# Altium project smartport_inverter.PrjPcb
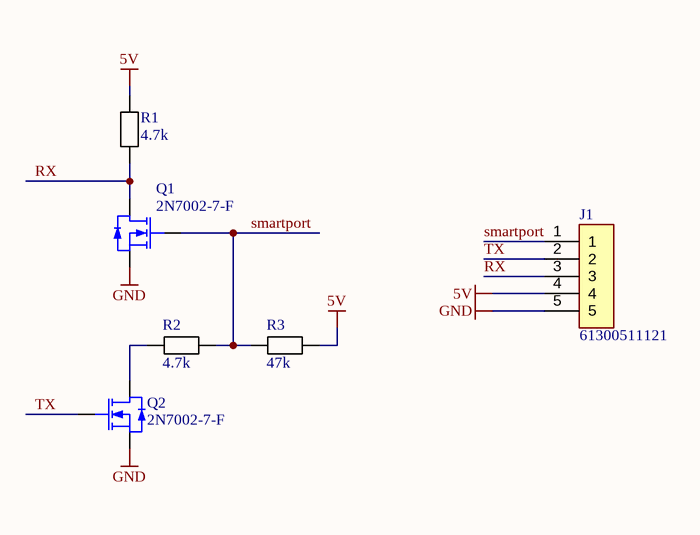
[diagram p0: smartport_inverter.SchDoc]
1 sheet, 6 parts. Net scope: hierarchical (ports join the sheet entries above them; power ports are global).
Board files: smartport_inverter_Panel5X5.PcbDoc, smartport_inverter.PcbDoc

## Sheet smartport_inverter.SchDoc
size 420 x 297 mm

### Parts
J1  61300511121  [61300511121]
Q1  2N7002-7-F  [SOT23-3N]
Q2  2N7002-7-F  [SOT23-3N]
R1  4.7k  [R0603]
R2  4.7k  [R0603]
R3  47k  [R0603]

### Nets
5V: J1.4 R1.2 R3.1
GND: J1.5 Q1.2(S) Q2.2(S)
RX: J1.3 Q1.3(D) R1.1
smartport: J1.1 Q1.1(G) R2.1 R3.2
TX: J1.2 Q2.1(G)
NetQ2_3: Q2.3(D) R2.2

### Notes on the sheet
- THIS DOCUMENT AND THE DATA DISCLOSED HEREIN OR
- HEREWITH IS THE PROPERTY OF ALTIUM LIMITED AND MAY
- DWG NO:
- REVISION
- REV:
- DESCRIPTION
- DATE
- APPROVED
- BE FREELY DISTRIBUTED IN WHOLE. NO RIGHTS ARE
- RESERVED OR EXPRESS OR IMPLIED WARANTEE GIVEN.
- ENG:
- APPROVALS
- PROJECT
- DSN:
- CHK:
- REFERENCE DOCUMENTS
- PROJECT REVISION:
- TITLE
- DOCUMENT REVISION:
- DESIGN ITEM:
- BOM:
- FAB DWG:
- PCB DWG:
- ASSY DWG:
- SCALE:
- A3
- SIZE
- CAGE CODE
- FILE NAME
- DWG NO.
- SHEET
- OF
- REV

### Library data of the parts
J1 = 61300511121: Headers & Wire Housings WR-PHD 2.54mm Hdr 5P Single Str Gold; Manufacturer: Wurth Elektronik; Manufacturer Part Number: 61300511121; Value: 61300511121
Q1 Q2 = 2N7002-7-F: MOSFET N-CH 60V 200MA SOT23-3; Manufacturer: Diodes Incorporated; Manufacturer Part Number: 2N7002-7-F; Value: 2N7002-7-F
R1 R2 = RES_YAG_RC0603FR-074K7L: Resistor 4.7k 0603 +-1% 0.1; Manufacturer: Yageo; Temperature Coefficient: +-200ppm°C; Power (Watts): 0.1; Voltage (V): 75; Part Number: RES_YAG_RC0603FR-074K7L; Manufacturer Part Number: RC0603FR-074K7L; Category: Resistor; Package / Case: 0603; Resistor (Ohms): 4.7k; Tolerance: +-1%; Operating Temperature: -55°C to +155°C; Thickness (mm): 0.45; Value: 4.7k
R3 = RES_YAG_RC0603FR-0747KL: Resistor 47k 0603 +-1% 0.1; Manufacturer: Yageo; Temperature Coefficient: +-200ppm°C; Power (Watts): 0.1; Voltage (V): 75; Part Number: RES_YAG_RC0603FR-0747KL; Manufacturer Part Number: RC0603FR-0747KL; Category: Resistor; Package / Case: 0603; Resistor (Ohms): 47k; Tolerance: +-1%; Operating Temperature: -55°C to +155°C; Thickness (mm): 0.45; Value: 47k